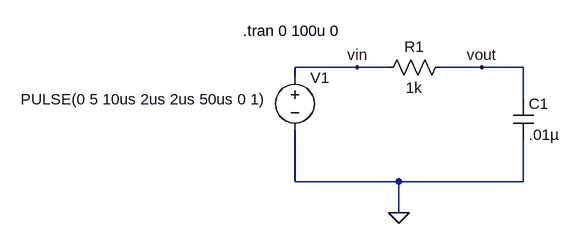
[diagram p0: schematic mutest.asc]
mutest.asc, the LTspice schematic file:
Version 4
SHEET 1 880 680
WIRE 176 160 80 160
WIRE 224 160 176 160
WIRE 368 160 304 160
WIRE 432 160 368 160
WIRE 80 176 80 160
WIRE 432 208 432 160
WIRE 80 336 80 256
WIRE 240 336 80 336
WIRE 432 336 432 272
WIRE 432 336 240 336
WIRE 240 384 240 336
FLAG 240 384 0
FLAG 176 160 vin
FLAG 368 160 vout
SYMBOL voltage 80 160 R0
WINDOW 3 -422 49 Left 2
SYMATTR InstName V1
SYMATTR Value PULSE(0 5 10us 2us 2us 50us 0 1)
SYMBOL cap 416 208 R0
SYMATTR InstName C1
SYMATTR Value .01µ
SYMBOL res 320 144 R90
WINDOW 0 0 56 VBottom 2
WINDOW 3 32 56 VTop 2
SYMATTR InstName R1
SYMATTR Value 1k
TEXT 0 104 Left 2 !.tran 0 100u 0

The netlist it stands for:
* mutest.asc
V1 vin 0 PULSE(0 5 10us 2us 2us 50us 0 1)
C1 vout 0 .01µ
R1 vout vin 1k
.tran 0 100u 0
.backanno
.end